# EAGLE design mpp_bldc (EAGLE 9.2.1)
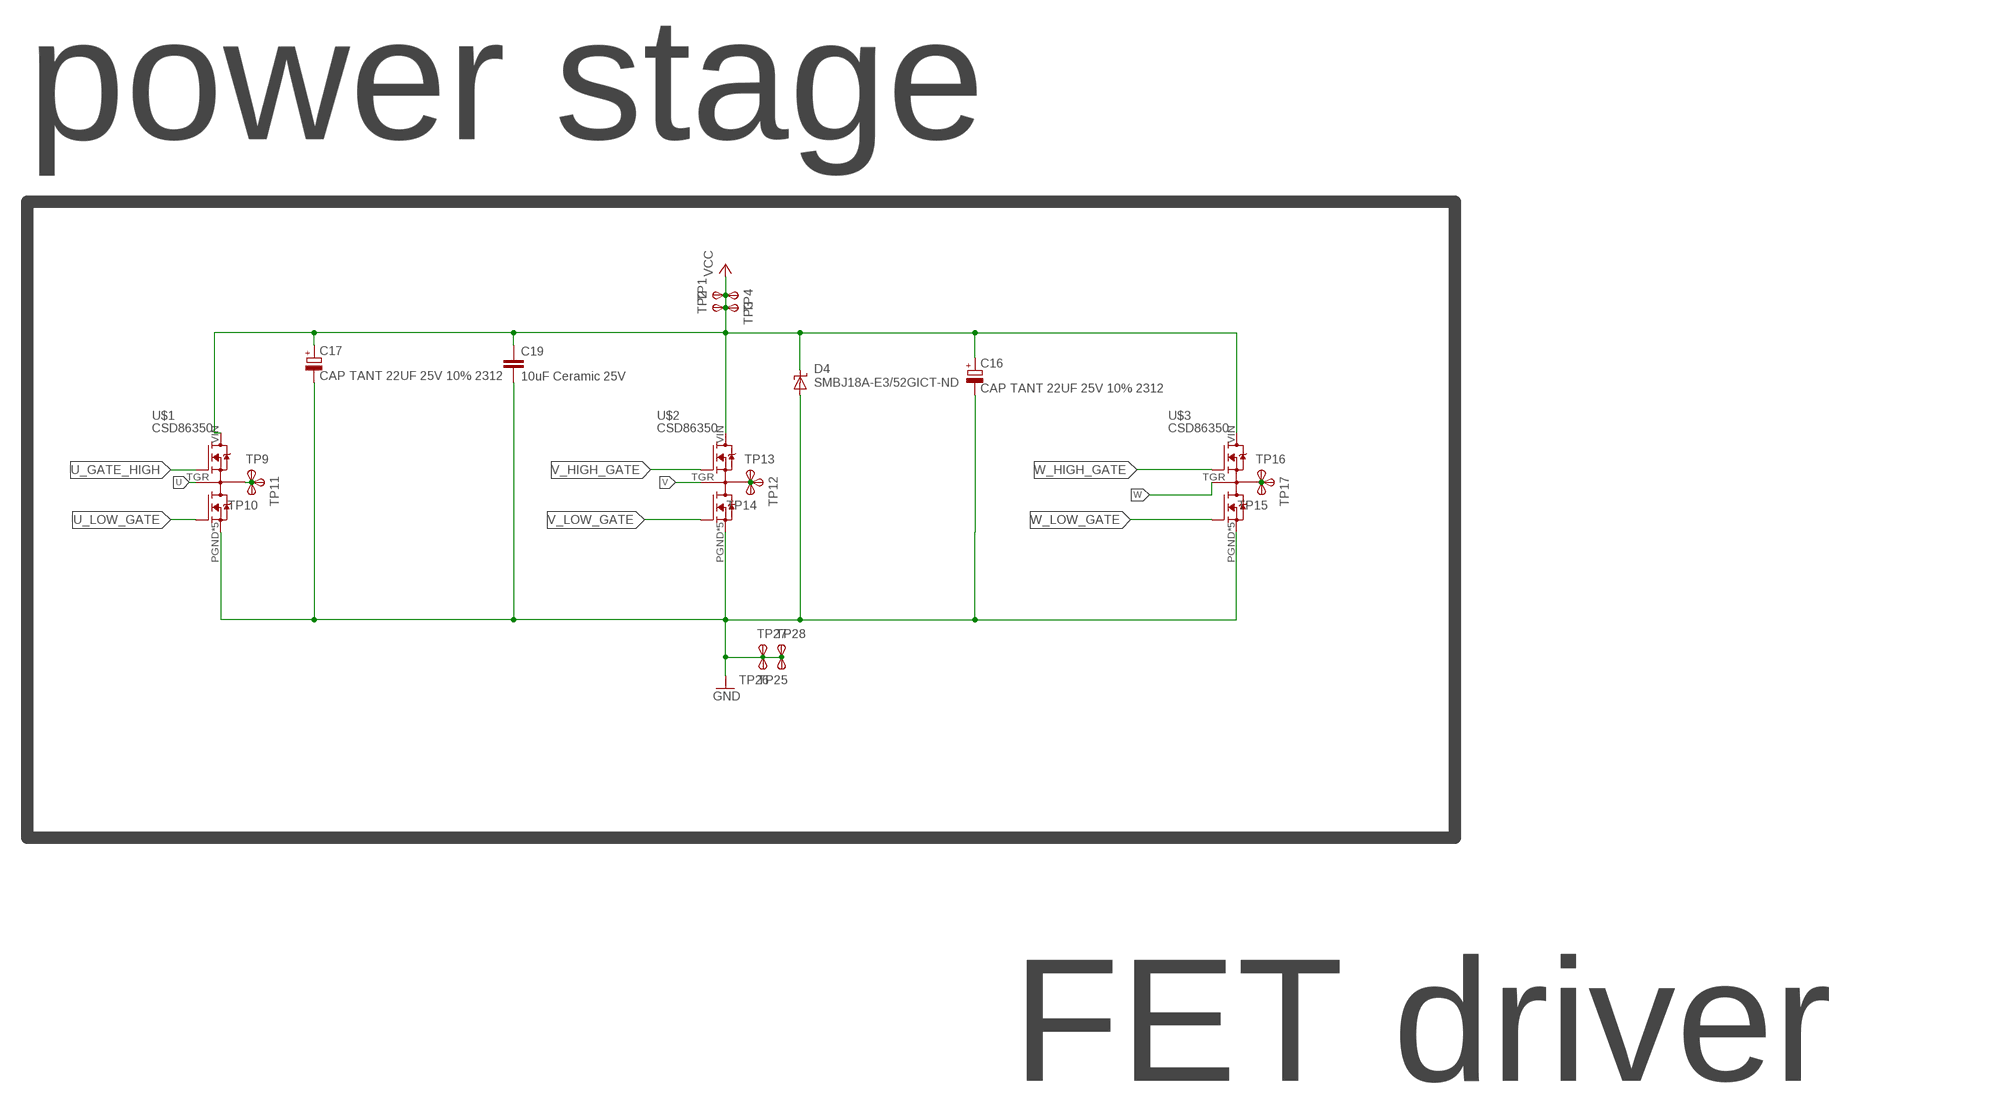
[diagram p0: schematic, sheet 1, part 1 of 2]
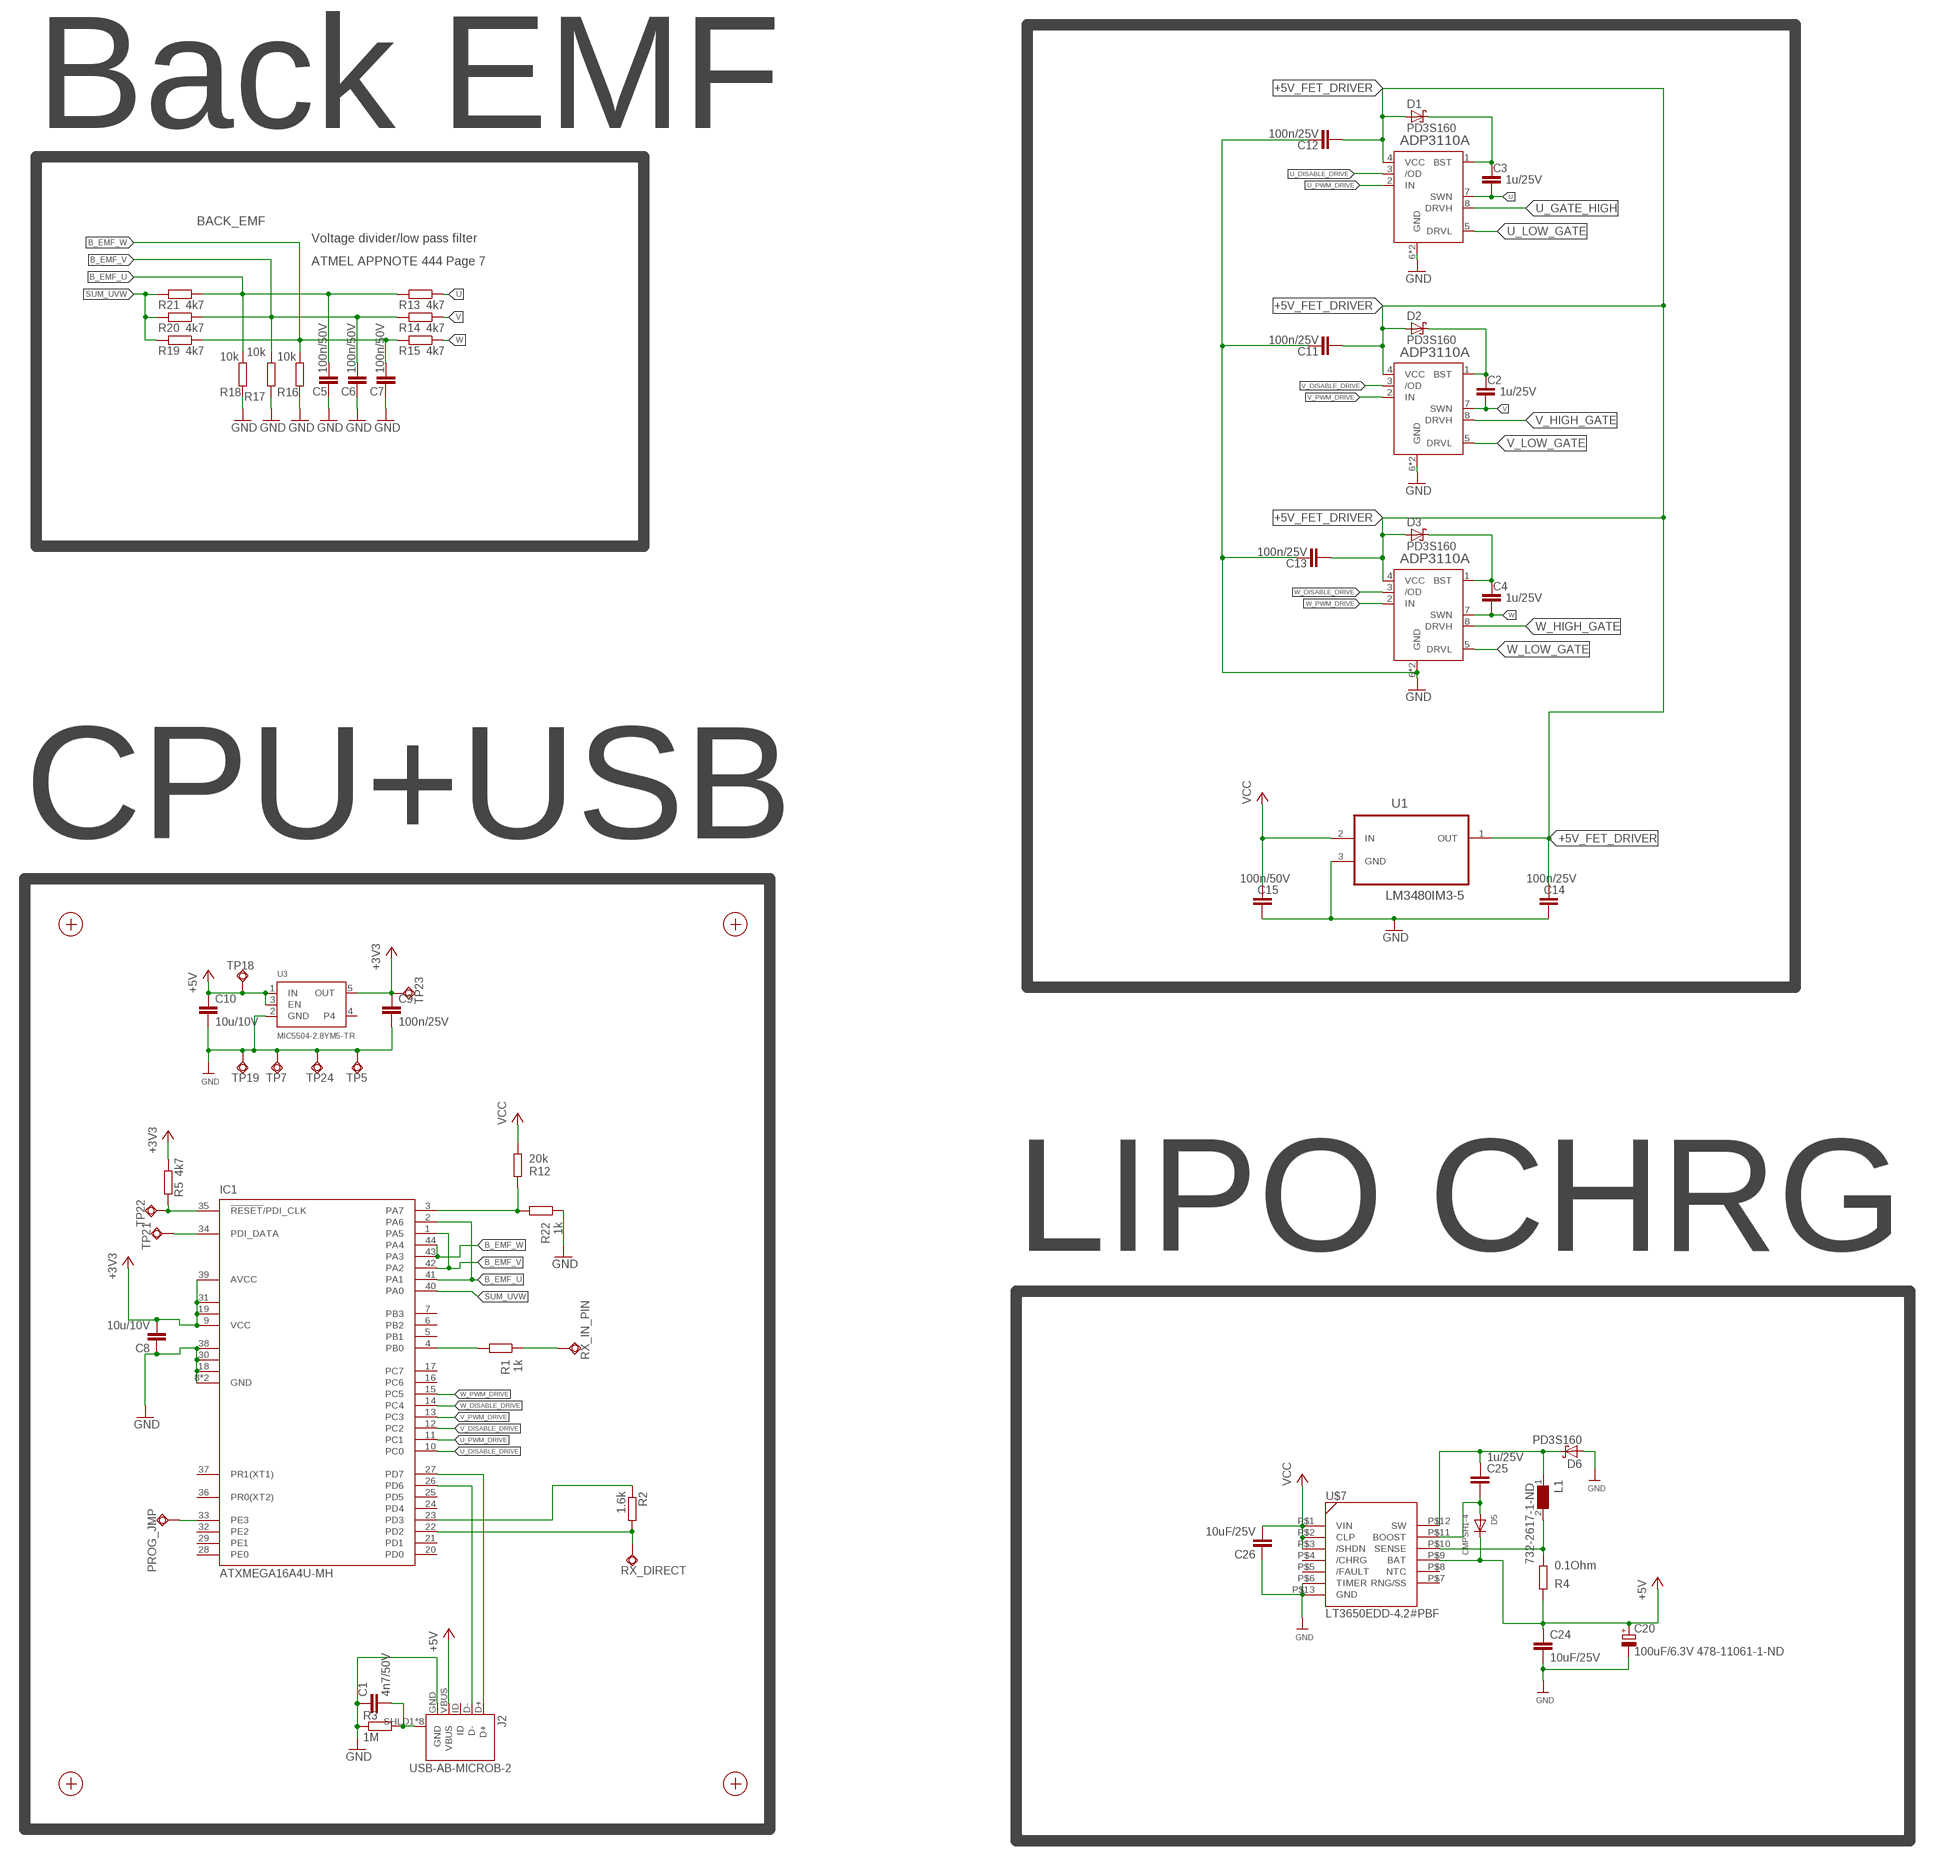
[diagram p1: schematic, sheet 1, part 2 of 2]

## Parts
C1  4n7/50V  C-EUC0603  [C0603]
C2  1u/25V  C-EUC0603  [C0603]
C3  1u/25V  C-EUC0603  [C0603]
C4  1u/25V  C-EUC0603  [C0603]
C5  100n/50V  C-EUC0603  [C0603]
C6  100n/50V  C-EUC0603  [C0603]
C7  100n/50V  C-EUC0603  [C0603]
C8  10u/10V  C-EUC0603K  [C0603K]
C9  100n/25V  C-EUC0603  [C0603]
C10  10u/10V  C-EUC0603K  [C0603K]
C11  100n/25V  C-EUC0603  [C0603]
C12  100n/25V  C-EUC0603  [C0603]
C13  100n/25V  C-EUC0603  [C0603]
C14  100n/25V  C-EUC0603  [C0603]
C15  100n/50V  C-EUC0603  [C0603]
C16  CAP TANT 22UF 25V 10% 2312  CPOL-EUC/6032-28R  [C/6032-28R]
C17  CAP TANT 22UF 25V 10% 2312  CPOL-EUC/6032-28R  [C/6032-28R]
C19  10uF Ceramic 25V  C-EUC1206  [C1206]
C20  100uF/6.3V 478-11061-1-ND  CPOL-EUCT7343  [CT7343]
C24  10uF/25V  C-EUC0805  [C0805]
C25  1u/25V  C-EUC0603  [C0603]
C26  10uF/25V  C-EUC0805  [C0805]
D1  PD3S160  [POWERDI323]
D2  PD3S160  [POWERDI323]
D3  PD3S160  [POWERDI323]
D4  SMBJ18A-E3/52GICT-ND  SUPPRESSOR-SMBJ  [SMBJ]
D5  CMPSH1-4  DIODESOT23_REFLOW  [SOT23-R]
D6  PD3S160  [POWERDI323]
IC1  ATXMEGA16A4U-MH  XMEGA16A4M1  [MLF44-TH]
J2  USB-AB-MICROB-2  [USB-MICROB-10118194]
L1  732-2617-1-ND  WE-TPC-744025001_2828  [WE-TPC_2828]
PROG_JMP  TPSQTP19SQ  [TP19SQ]
R1  1k  R-EU_R0603  [R0603]
R2  1.6k  R-EU_R0603  [R0603]
R3  1M  R-EU_R0603  [R0603]
R4  0.1Ohm  R-EU_R0402  [R0402]
R5  4k7  R-EU_R0603  [R0603]
R12  20k  R-EU_R0603  [R0603]
R13  4k7  R-EU_R0603  [R0603]
R14  4k7  R-EU_R0603  [R0603]
R15  4k7  R-EU_R0603  [R0603]
R16  10k  R-EU_R0603  [R0603]
R17  10k  R-EU_R0603  [R0603]
R18  10k  R-EU_R0603  [R0603]
R19  4k7  R-EU_R0603  [R0603]
R20  4k7  R-EU_R0603  [R0603]
R21  4k7  R-EU_R0603  [R0603]
R22  1k  R-EU_R0603  [R0603]
RX_DIRECT  TPSQTP19SQ  [TP19SQ]
RX_IN_PIN  TPSQTP19SQ  [TP19SQ]
TP1  TPSTP20SQ  [TP20SQ]
TP2  TPSTP20SQ  [TP20SQ]
TP3  TPSTP20SQ  [TP20SQ]
TP4  TPSTP20SQ  [TP20SQ]
TP5  TPSQTP19SQ  [TP19SQ]
TP7  TPSQTP19SQ  [TP19SQ]
TP9  TPSTP20SQ  [TP20SQ]
TP10  TPSTP20SQ  [TP20SQ]
TP11  TPSTP20SQ  [TP20SQ]
TP12  TPSTP20SQ  [TP20SQ]
TP13  TPSTP20SQ  [TP20SQ]
TP14  TPSTP20SQ  [TP20SQ]
TP15  TPSTP20SQ  [TP20SQ]
TP16  TPSTP20SQ  [TP20SQ]
TP17  TPSTP20SQ  [TP20SQ]
TP18  TPSQTP19SQ  [TP19SQ]
TP19  TPSQTP19SQ  [TP19SQ]
TP21  TPSQTP15R  [TP15R]
TP22  TPSQTP14SQ  [TP14SQ]
TP23  TPSQTP14SQ  [TP14SQ]
TP24  TPSQTP14SQ  [TP14SQ]
TP25  TPSTP20SQ  [TP20SQ]
TP26  TPSTP20SQ  [TP20SQ]
TP27  TPSTP20SQ  [TP20SQ]
TP28  TPSTP20SQ  [TP20SQ]
U1  LM3480IM3-5  LM3480IM3-12  [SOT95P251X112-3N]
U3  MIC5504-2.8YM5-TR  VREG_SOT23-5  [SOT23-5]
U$1  CSD86350  [Q5D]
U$2  CSD86350  [Q5D]
U$3  CSD86350  [Q5D]
U$4  ADP3110A  [DFN-8]
U$5  ADP3110A  [DFN-8]
U$6  ADP3110A  [DFN-8]
U$7  LT3650EDD-4.2#PBF  LT3650-4.2  [12-WFDFN]
X1  PASSER-07  [PASSER_07MM]
X2  PASSER-07  [PASSER_07MM]
X3  PASSER-07  [PASSER_07MM]
X4  PASSER-07  [PASSER_07MM]

## Nets
+3V3: C8.2 C9.1 IC1.9(VCC) IC1.19(VCC1) IC1.31(VCC2) IC1.39(AVCC) R5.1 TP23.TP U3.5(OUT)
+5V: C10.1 C20.+ C24.1 D5.3(C) J2.VBUS R4.2 TP18.TP U3.1(IN) U3.3(EN) U$7.P$9(BAT)
+5V_FET_DRIVER: C11.2 C12.2 C13.2 C14.2 D1.A D2.A D3.A U1.1(OUT) U$4.4(VCC) U$5.4(VCC) U$6.4(VCC)
B_EMF_U: C5.1 IC1.2(PA6) IC1.41(PA1) R13.2 R18.1 R21.1
B_EMF_V: C6.1 IC1.1(PA5) IC1.42(PA2) R14.2 R17.1 R20.1
B_EMF_W: C7.1 IC1.43(PA3) IC1.44(PA4) R15.2 R16.1 R19.1
GND: C1.1 C5.2 C6.2 C7.2 C8.1 C9.2 C10.2 C11.1 C12.1 C13.1 C14.1 C15.1 C16.- C17.- C19.2 C20.- C24.2 C26.1 D4.A D6.A IC1.8(GND) IC1.18(GND1) IC1.30(GND2) IC1.38(GND3) IC1.TH(GND) J2.GND R3.1 R16.2 R17.2 R18.2 R22.1 TP5.TP TP7.TP TP19.TP TP24.TP TP25.TP(PP) TP26.TP(PP) TP27.TP(PP) TP28.TP(PP) U1.3(GND) U3.2(GND) U$1.PGND U$1.PGND0(PGND) U$1.PGND1(PGND) U$1.PGND2(PGND) U$1.PGND3(PGND) U$2.PGND U$2.PGND0(PGND) U$2.PGND1(PGND) U$2.PGND2(PGND) U$2.PGND3(PGND) U$3.PGND U$3.PGND0(PGND) U$3.PGND1(PGND) U$3.PGND2(PGND) U$3.PGND3(PGND) U$4.6(GND) U$4.PAD(GND) U$5.6(GND) U$5.PAD(GND) U$6.6(GND) U$6.PAD(GND) U$7.P$6(TIMER) U$7.P$13(GND)
N$1: IC1.33(PE3) PROG_JMP.TP
N$2: IC1.3(PA7) R12.2 R22.2
N$3: C3.2 D1.C U$4.1(BST)
N$4: IC1.27(PD7) J2.D+
N$5: IC1.26(PD6) J2.D-
N$6: C2.2 D2.C U$5.1(BST)
N$7: C4.2 D3.C U$6.1(BST)
N$12: C25.1 D6.C L1.1 U$7.P$12(SW)
N$14: L1.2 R4.1 U$7.P$10(SENSE)
N$15: C1.2 J2.SHLD1(SHIELD) J2.SHLD2(SHIELD) J2.SHLD3(SHIELD) J2.SHLD4(SHIELD) J2.SHLD5(SHIELD) J2.SHLD6(SHIELD) J2.SHLD7(SHIELD) J2.SHLD8(SHIELD) R3.2
N$16: C25.2 D5.1(A) U$7.P$11(BOOST)
PDI_DATA: IC1.34(PDI_DATA) TP21.TP
RC_SIG_IC: IC1.4(PB0) R1.2
RC_SIG_RCV: R1.1 RX_IN_PIN.TP
RST_PDICLK: IC1.35(!RESET!/PDI_CLK) R5.2 TP22.TP
RX_DIRECT_PD2: IC1.22(PD2) R2.2 RX_DIRECT.TP
SUM_UVW: IC1.40(PA0) R19.2 R20.2 R21.2
TX_DIRECT_PD3: IC1.23(PD3) R2.1
U: C3.1 R13.1 U$1.TGR U$4.7(SWN)
U_DISABLE_DRIVE: IC1.10(PC0) U$4.3(/OD)
U_GATE_HIGH: U$1.TG U$4.8(DRVH)
U_LOW_GATE: U$1.BG U$4.5(DRVL)
U_PWM_DRIVE: IC1.11(PC1) U$4.2(IN)
UMOT: TP9.TP(PP) TP10.TP(PP) TP11.TP(PP) U$1.VSW0(VSW) U$1.VSW1(VSW) U$1.VSW2(VSW)
V: C2.1 R14.1 U$2.TGR U$5.7(SWN)
V_DISABLE_DRIVE: IC1.12(PC2) U$5.3(/OD)
V_HIGH_GATE: U$2.TG U$5.8(DRVH)
V_LOW_GATE: U$2.BG U$5.5(DRVL)
V_PWM_DRIVE: IC1.13(PC3) U$5.2(IN)
VCC: C15.2 C16.+ C17.+ C19.1 C26.2 D4.C R12.1 TP1.TP(PP) TP2.TP(PP) TP3.TP(PP) TP4.TP(PP) U1.2(IN) U$1.VIN U$2.VIN U$3.VIN U$7.P$1(VIN) U$7.P$2(CLP) U$7.P$3(/SHDN)
VMOT: TP12.TP(PP) TP13.TP(PP) TP14.TP(PP) U$2.VSW0(VSW) U$2.VSW1(VSW) U$2.VSW2(VSW)
W: C4.1 R15.1 U$3.TGR U$6.7(SWN)
W_DISABLE_DRIVE: IC1.14(PC4) U$6.3(/OD)
W_HIGH_GATE: U$3.TG U$6.8(DRVH)
W_LOW_GATE: U$3.BG U$6.5(DRVL)
W_PWM_DRIVE: IC1.15(PC5) U$6.2(IN)
WMOT: TP15.TP(PP) TP16.TP(PP) TP17.TP(PP) U$3.VSW0(VSW) U$3.VSW1(VSW) U$3.VSW2(VSW)
Unconnected: IC1.5(PB1) IC1.6(PB2) IC1.7(PB3) IC1.16(PC6) IC1.17(PC7) IC1.20(PD0) IC1.21(PD1) IC1.24(PD4) IC1.25(PD5) IC1.28(PE0) IC1.29(PE1) IC1.32(PE2) IC1.36(PR0(XT2)) IC1.37(PR1(XT1)) J2.ID U3.4 U$7.P$4(/CHRG) U$7.P$5(/FAULT) U$7.P$7(RNG/SS) U$7.P$8(NTC)

## Notes on the sheet
- power stage
- FET driver
- Back EMF
- BACK_EMF
- Voltage divider/low pass filter
- ATMEL APPNOTE 444 Page 7
- CPU+USB
- LIPO CHRG

## Library data of the parts
C1-C15 C24-C26 = rcl:C-EU: CAPACITOR, European symbol
C16 C17 = rcl:CPOL-EU: POLARIZED CAPACITOR, European symbol; SPICEPREFIX: C
C19 = rcl:C-EU: CAPACITOR, European symbol; SPICEPREFIX: C
C20 = rcl:CPOL-EU: POLARIZED CAPACITOR, European symbol
D1-D3 = mpp_bldc_ng_2:PD3S160: 1.0A SURFACE MOUNT SCHOTTKY BARRIER RECTIFIER POWERDI ® 323 Source: http://www.diodes.com/datasheets/ds30899.pdf
D4 = diode:SUPPRESSOR-: Suppressor diode
D5 = adafruit:DIODE: Diode SMADIODE - SMA Surface Mount Package 20V 1A Schottky Diode Digikey: 641-1014-6-ND DO-1N4148 - Through Hole Small Current Diode SOD-123 20V 1 A (.5mV Vf) Schottky Diode - Digikey: MBRX120TPMSCT-ND SOD-323 10V 570mA (.38mV Vf, 3ns) Schottky Diode - Digikey: ZLLS410CT-ND SOD-523 30V 30mA Schottky Diode (RB751S-40TE61) - Digikey: RB751S-40TE61CT-ND SOT23-R/W - SOT23 Package (R = Solder Paste/Reflow Ovens, W = Hand-Soldering) BAT54Film 40V 300mA - Digikey: 497-7162-1-ND
D6 = diode:PD3S160: 1.0A SURFACE MOUNT SCHOTTKY BARRIER RECTIFIER POWERDI ® 323 Source: http://www.diodes.com/datasheets/ds30899.pdf
IC1 = atmel:XMEGA16A4: MICROCONTROLLER Features High-performance, Low-power 8/16-bit AVR XMEGA Microcontroller Non-Volatile Program and Data Memories - 16 KB - 128 KB of In-System Self-Programmable Flash - 4 KB - 8 KB Boot Code Section with Independent Lock Bits - 1 KB - 2 KB EEPROM - 2 KB - 8 KB Internal SRAM Peripheral Features - Four-channel DMA Controller with support for external requests - Eight-channel Event System - Five 16-bit Timer/Counters Three Timer/Counters with 4 Output Compare or Input Capture channels Two Timer/Counters with 2 Output Compare or Input Capture channels High-Resolution Extensions on all Timer/Counters Advanced Waveform Extension on one Timer/Counter - Five USARTs IrDA Extension on one USART - Two Two-Wire Interfaces with dual address match (I2C and SMBus compatible) - Two SPIs (Serial Peripheral Interfaces) peripherals - AES and DES Crypto Engine - 16-bit Real Time Counter with Separate Oscillator - One Twelve-channel, 12-bit, 2 Msps Analog to Digital Converter - One Two-channel, 12-bit, 1 Msps Digital to Analog Converter - Two Analog Comparators with Window compare function - External Interrupts on all General Purpose I/O pins - Programmable Watchdog Timer with Separate On-chip Ultra Low Power Oscillator Special Microcontroller Features - Power-on Reset and Programmable Brown-out Detection - Internal and External Clock Options with PLL - Programmable Multi-level Interrupt Controller - Sleep Modes: Idle, Power-down, Standby, Power-save, Extended Standby - Advanced Programming, Test and Debugging Interfaces PDI (Program and Debug Interface) for programming, test and debugging I/O and Packages - 34 Programmable I/O Lines - 44 - lead TQFP - 44 - pad VQFN/QFN - 49 - ball VFBGA Operating Voltage - 1.6 - 3.6V Speed performance - 0 - 12 MHz @ 1.6 - 3.6V - 0 - 32 MHz @ 2.7 - 3.6V Drawn by Dipl.-Ing. (FH) Robert Siegler Created: 27.05.09; OC_FARNELL: unknown; OC_NEWARK: unknown
J2 = mpp_bldc_ng_2:USB-AB: USB Connectors with ID-Pin (5 Pins); DIGIKEY: 609-4618-6-ND
L1 = WE-TPC:WE-TPC: Shielded Tiny Power Inductor WE-TPC - Extremely flat power inductor - High current capability - High reliability and perfect soldering characteristics because of integrated soldering pad - magnetically shielded -- Portable power like PDA, digital camera, PCMICA-cards and displays -- DC/DC-converter -- Recommended for switching regulator IC's from Linear Technology, National Semiconductor, Texas Instruments and Fairchild Semiconductor; MPN: 744025001; OC_FARNELL: 1869740; OC_NEWARK: 32T8552; PACKAGE: 2828; SUPPLIER: WURTH ELEKTRONIK
PROG_JMP RX_DIRECT RX_IN_PIN TP5 TP7 TP18 TP19 TP21-TP24 = testpad:TPSQ: Test pad
R1 R4 R5 R12-R22 = rcl:R-EU_: RESISTOR, European symbol
R2 R3 = resistor:R-EU_: RESISTOR, European symbol
TP1-TP4 TP9-TP17 TP25-TP28 = testpad:TPS: TEST PIN
U1 = linear:LM3480IM3-12: Low-Dropout Linear Voltage; MPN: LM3480IM3-12; OC_FARNELL: 1469099; OC_NEWARK: -; PACKAGE: SOT-3; SUPPLIER: National Semiconductor
U3 = microbuilder:VREG_SOT23-5: SOT23-5 Fixed Voltage Regulators To better organise some of the SOT23-5 fixed voltage regulators in this library, this new part was created. Part Current Out V Out V In V Dropout Digikey Part No. ADP121 150mA 3.3V 3.4-5.5V 0.09V @ 150mA ADP121-AUJZ33R7CT-ND ADP121 150mA 3.0V 3.1-5.5V 0.09V @ 150mA ADP121-AUJZ30R7CT-ND ADP122 300mA 3.3V 3.4-5.5V 0.085V @ 300mA ADP122AUJZ-3.3-R7CT-ND ADP1712 300mA 3.3V 3.5-5.5V 0.17V @ 300mA ADP1712AUJZ-3.3-R7TR-ND AP7311 (Low Cost) 150mA 3.3V 3.5-6V 0.15V @ 150mA AP7311-33WG-7DICT-ND LD39015M18R 150mA 1.8V 1.9V-5.5V 0.08V @ 100mA 497-6977-1-ND MCP1824T-3302E/OT 300mA 3.3V 3.5V-6V 0.2V @ 300mA MCP1824T-3302E/OTCT-ND MIC5205-2.5YM5 TR 150mA 2.5V 2.7-16V 0.165V @ 150mA 576-1257-2-ND MIC5205-3.0YM5 TR 150mA 3.0V 3.2V-16V 0.165V @ 150mA 576-1258-2-ND MIC5205-3.3YM5 TR 150mA 3.3V 3.5V-16V 0.165V @ 150mA 576-1259-2-ND TPS780330220 150mA 3.3V+2.2V 3.6-5.5V 250mV Max 296-23332-1-ND TDA3663/N1,135 100mA 3.3V 3.5-45V 0.18V @ 50mA 568-5343-1-ND
U$1-U$3 = mpp_bldc_ng_2:CSD86350
U$4-U$6 = mpp_bldc_ng_2:ADP3110A: High and Low Fet Driver
U$7 = mpp_bldc_ng_2:LT3650-4.2
X1-X4 = we-symbol:PASSER: Fiducial Marker

## Board
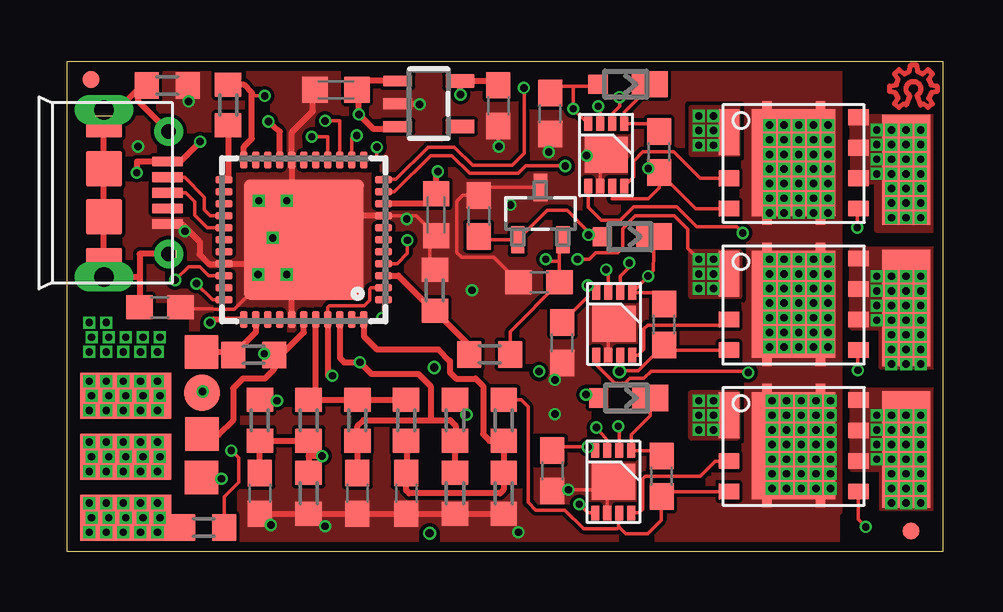
[diagram p2: board, top side]
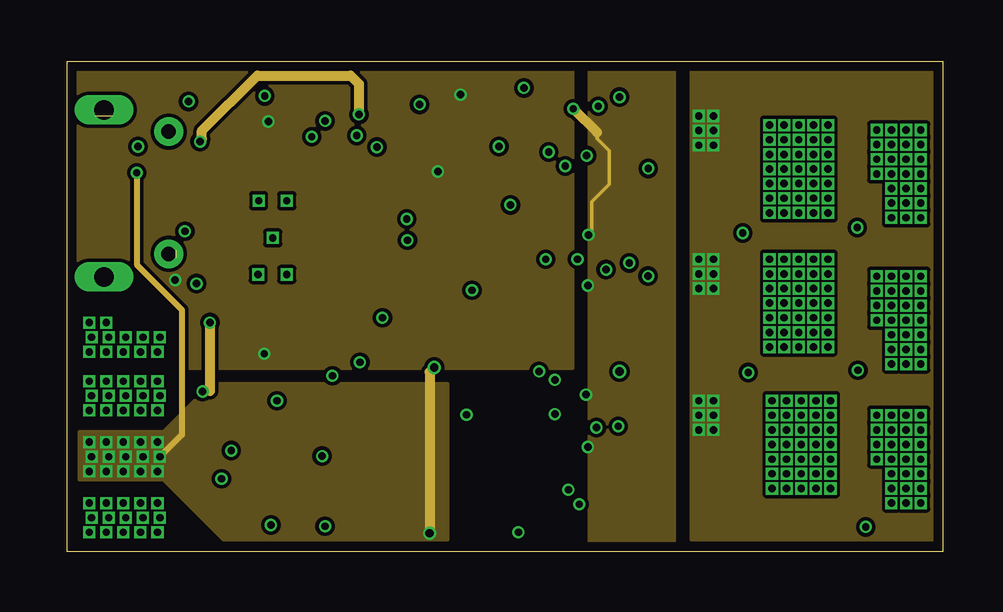
[diagram p3: board, inner layer Route3]
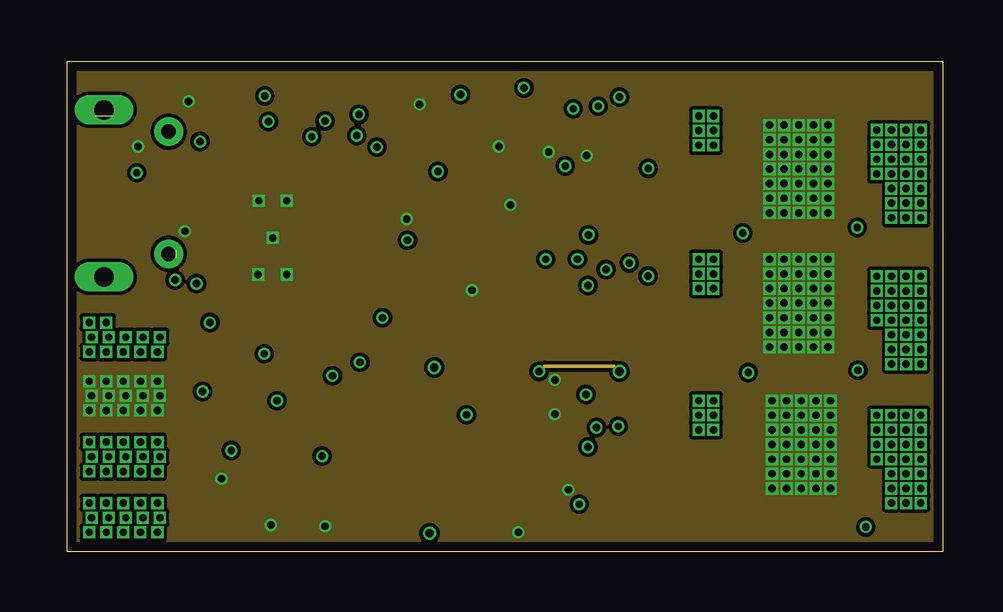
[diagram p4: board, inner layer Route14]
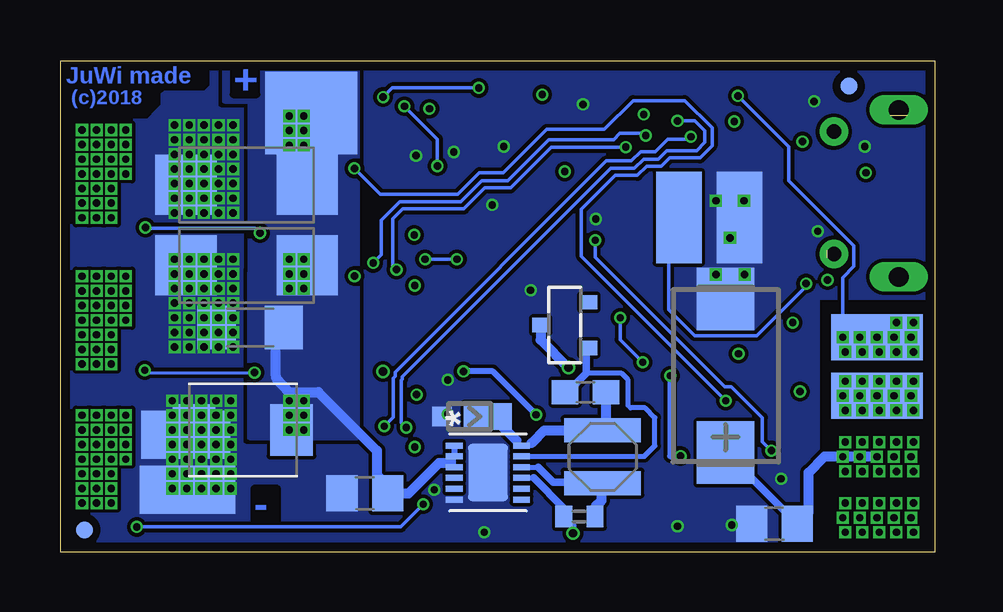
[diagram p5: board, bottom side, seen from below]

Size 36.47 x 20.45 mm. Coordinates in mm from the lower left corner, seen from the top.
Outline: 0,0 0,20.45 36.47,20.45 36.47,0 0,0
Copper layers (1+2*15+16): Top 0.035mm / dielectric 0.35mm / Route3 0.035mm / dielectric 0.76mm / Route14 0.035mm / dielectric 0.35mm / Bottom 0.035mm
Design rules "we-dru-4-layer *": minimum track width 0.15mm, minimum drill 0.3mm, track to track 0.15mm, track to pad 0.15mm, pad to pad 0.15mm, via to via 0.15mm, smd to smd 0mil, copper to edge 0.4mm, drill to drill 0.2mm, minimum pad ring 0.18mm, minimum via ring 0.1mm, stop-mask expansion 0.1mm, vias tented up to drill 0.5mm, thermal gap 0.25mm

### Footprints (pad centres in the part's own frame; a part is rotated, then mirrored left to right if it is on the bottom)
C0603 = smd 1.1 x 1: 1 -0.85,0; 2 0.85,0
C0603K = smd 1.05 x 1.08: 1 -0.875,0; 2 0.875,0
C/6032-28R = smd 2.55 x 2.5: + 2.525,0; - -2.525,0
C1206 = smd 1.6 x 1.8: 1 -1.4,0; 2 1.4,0
CT7343 = smd 2.6 x 2.4: + -3.2,0; - 3.2,0
C0805 = smd 1.3 x 1.5: 1 -0.95,0; 2 0.95,0
POWERDI323 = smd 0.8 x 0.8: A 1.15,0 | smd 1.492 x 1.1: C -1.004,0
SMBJ = smd 1.78 x 2.16: A 2.04,0; C -2.03,0
SOT23-R = smd 0.6 x 0.7: 1 -0.95,-1; 2 0.95,-1; 3 0,1
POWERDI323' = smd 0.8 x 0.8: A 1.15,0 | smd 2 x 1.1: C -0.75,0
MLF44-TH = smd 0.7 x 0.3: 1 -3.325,2.5; 2 -3.325,2; 3 -3.325,1.5; 4 -3.325,1; 5 -3.325,0.5; 6 -3.325,0; 7 -3.325,-0.5; 8 -3.325,-1; 9 -3.325,-1.5; 10 -3.325,-2; 11 -3.325,-2.5; 23 3.325,-2.5; 24 3.325,-2; 25 3.325,-1.5; 26 3.325,-1; 27 3.325,-0.5; 28 3.325,0; 29 3.325,0.5; 30 3.325,1; 31 3.325,1.5; 32 3.325,2; 33 3.325,2.5 | smd 0.3 x 0.7: 12 -2.5,-3.325; 13 -2,-3.325; 14 -1.5,-3.325; 15 -1,-3.325; 16 -0.5,-3.325; 17 0,-3.325; 18 0.5,-3.325; 19 1,-3.325; 20 1.5,-3.325; 21 2,-3.325; 22 2.5,-3.325; 34 2.5,3.325; 35 2,3.325; 36 1.5,3.325; 37 1,3.325; 38 0.5,3.325; 39 0,3.325; 40 -0.5,3.325; 41 -1,3.325; 42 -1.5,3.325; 43 -2,3.325; 44 -2.5,3.325 | smd 5 x 5: TH 0,0
USB-MICROB-10118194 = smd 1.3 x 0.4: D+ -2.5,0; D- -2.5,-0.65; GND -2.5,1.3; ID -2.5,0.65; VBUS -2.5,-1.3 | drill 0.6 pad 1.2: SHLD1 -2.55,2.55; SHLD2 -2.55,-2.55 | drill 0.813 pad 1.219 long: SHLD3 0.15,3.5; SHLD4 0.15,-3.45 | smd 1.5 x 1.1: SHLD5 0.15,2.85; SHLD6 0.15,-2.85 | smd 1.5 x 1.5: SHLD7 0.15,1; SHLD8 0.15,-1
WE-TPC_2828 = smd 3.2 x 1: 1 0,1.1; 2 0,-1.1
TP19SQ = smd 3.81 x 1.9: TP 0,0
R0603 = smd 1 x 1.1: 1 -0.85,0; 2 0.85,0
R0402 = smd 0.7 x 0.9: 1 -0.65,0; 2 0.65,0
TP20SQ = smd 2 x 2: TP 0,0
TP15R = smd 1.5 x 1.5: TP 0,0
TP14SQ = smd 1.4 x 1.4: TP 0,0
SOT95P251X112-3N = smd 0.559 x 1.143: 1 -0.94,-1.092; 2 0.94,-1.092; 3 0,1.092
SOT23-5 = smd 0.457 x 1.2: 1 -0.95,-1.3; 2 0,-1.3; 3 0.95,-1.3 | smd 0.55 x 1.2: 4 0.95,1.3; 5 -0.95,1.3
Q5D = smd 0.85 x 0.65: BG 2.686,-1.958; TG -2.704,-0.688; TGR -2.704,-1.958; VSW0 2.686,1.852; VSW1 2.686,0.582; VSW2 2.686,-0.688 | smd 3.48 x 4.46: PGND -0.024,-0.048 | smd 0.4 x 0.345: PGND0 -1.124,2.352; PGND1 1.116,2.352; PGND2 -1.124,-2.448; PGND3 1.116,-2.448 | smd 0.85 x 1.92: VIN -2.704,1.222
DFN-8 = smd 0.6 x 0.33: 1 -1.3,0.725; 2 -1.3,0.225; 3 -1.3,-0.275; 4 -1.3,-0.775; 5 1.3,-0.775; 6 1.3,-0.275; 7 1.3,0.225; 8 1.3,0.725 | smd 1.5 x 1.8: PAD 0,-0.025
12-WFDFN = smd 0.25 x 0.7: P$1 -1.125,-1.4; P$2 -0.675,-1.4; P$3 -0.225,-1.4; P$4 0.225,-1.4; P$5 0.675,-1.4; P$6 1.125,-1.4; P$7 1.125,1.4; P$8 0.675,1.4; P$9 0.225,1.4; P$10 -0.225,1.4; P$11 -0.675,1.4; P$12 -1.125,1.4 | smd 2.38 x 1.65: P$13 0,0
PASSER_07MM = smd 0.7 x 0.7: X 0,0

### Placement (x,y rotation side)
C1  3.86,10.19 180 top
C2  24.87,9.47 90 top
C3  24.66,16.66 90 top
C4  24.77,3.15 90 top
C5  8.03,2.44 270 top
C6  12.09,2.44 270 top
C7  14.12,2.44 270 top
C8  15.37,14.05 90 top
C9  17.96,18.59 270 top
C10  11.2,19.25 180 top
C11  20.12,18.26 90 top
C12  20.62,8.71 90 top
C13  20.22,3.38 90 top
C14  17.14,14 270 top
C15  19.66,11.23 0 top
C16  28.7,15.29 0 bottom
C17  28.7,11.94 0 bottom
C19  28.55,9.35 180 bottom
C20  8.74,7.34 90 bottom
C24  6.71,1.17 180 bottom
C25  14.58,6.65 180 bottom
C26  23.77,2.44 0 bottom
D1  23.27,19.48 180 top
D2  23.44,13.13 180 top
D3  23.29,6.41 180 top
D4  28.85,5.08 180 bottom
D5  15.44,9.45 90 bottom
D6  PD3S160  [POWERDI323']  19.41,5.64 180 bottom
IC1  9.86,13 180 top
J2  1.68,14.96 180 top
L1  13.87,3.96 0 bottom
PROG_JMP  10.69,13.94 270 bottom
R1  5.69,1.02 0 top
R2  6.71,18.62 90 top
R3  4.17,19.43 180 top
R4  14.83,1.47 180 bottom
R5  7.77,8.2 180 top
R12  17.6,8.23 180 top
R13  8.03,5.49 270 top
R14  16.15,5.49 270 top
R15  18.19,5.49 270 top
R16  18.19,2.44 270 top
R17  16.15,2.44 270 top
R18  10.06,2.44 270 top
R19  14.12,5.49 90 top
R20  12.09,5.49 90 top
R21  10.06,5.49 90 top
R22  15.32,10.9 270 top
RX_DIRECT  2.44,8.94 0 bottom
RX_IN_PIN  2.44,1.42 0 top
TP1  25.1,17.58 0 bottom
TP2  26.92,19 0 bottom
TP3  26.92,17.58 0 bottom
TP4  25.1,19 0 bottom
TP5  8.16,13.94 90 bottom
TP7  2.44,6.5 0 bottom
TP9  34.95,17.22 0 top
TP10  34.95,16.26 0 top
TP11  34.95,14.63 0 top
TP12  34.95,11.58 0 top
TP13  34.95,10.16 0 top
TP14  34.95,8.74 0 top
TP15  34.95,2.84 0 top
TP16  34.95,4.27 0 top
TP17  34.95,5.69 0 top
TP18  2.44,3.96 180 top
TP19  2.44,6.5 180 top
TP21  5.61,6.63 90 top
TP22  5.59,8.33 90 top
TP23  5.61,4.9 90 top
TP24  5.59,3.1 90 top
TP25  30.38,4.88 0 bottom
TP26  32.08,4.88 0 bottom
TP27  32.16,2.59 0 bottom
TP28  30.18,2.59 0 bottom
U1  19.71,14.1 0 top
U3  15.06,18.67 270 top
U$1  30.28,16.26 0 top
U$2  30.28,10.36 0 top
U$3  30.28,4.47 0 top
U$4  22.48,16.54 270 top
U$5  22.81,9.5 270 top
U$6  22.78,2.92 270 top
U$7  18.64,3.3 270 bottom
U$11  [OSHW_2MM]  35.26,19.41 0 top
X1  35.15,0.86 0 top
X2  0.99,19.68 0 top
X3  35.46,0.91 0 bottom
X4  3.61,19.41 0 bottom

### Tracks (layer width: path | path; a pad name or v marks a point on that pad's centre or on a via)
+3V3  (via drill 0.3)
  Top 0.152: IC1.31 5.89,11.51 5.51,11.89 5.05,11.89 v4.5,11.33 | R5.1 8.57,8.26 v8.2,8.26
  Top 0.254: C9.1 17.88,19.62 U3.5 16.36,19.07 v16.38,19.05 | v15.44,15.85 15.37,15.77 C8.2 14.95,14.51 IC1.9 | IC1.19 8.86,17.51 v8.38,17.93 | IC1.39 9.86,9.14 8.91,8.2 R5.1 8.62,7.61 8.23,7.21 7.32,7.21 6.91,6.81 6.91,5.49 6.3,4.88 5.64,4.88 TP23.TP
  pour Route3 (no thermals): -0.15,20.55 21.06,20.55 21.06,7.65 -0.15,7.65
+5V  (via drill 0.3, 0.35)
  Top 0.254: v0.91,3.35 v1.02,3.96 v0.91,4.57 v1.63,4.57 v1.73,3.96 v1.63,3.35 v2.34,3.35 TP18.TP | TP18.TP v2.34,4.57 | TP18.TP v3.15,3.96 | v3.15,3.96 v3.05,4.57 | v3.15,3.96 3.05,3.86 | 3.05,3.86 2.44,3.86 TP18.TP | 3.05,3.86 v3.05,3.35 v3.76,3.35 v3.86,3.96 v3.76,4.57 | v2.9,15.8 2.9,16.26 J2.VBUS 4.7,16.26 v5.54,17.09 | U3.3 13.67,17.63 12.75,17.63 v12.15,18.23 C10.1 12.52,19.62 U3.1
  Route3 0.254: v2.9,15.8 2.9,11.96 4.78,10.08 4.78,4.88 v3.86,3.96
  Route3 0.305: v15.1,0.78
  Route3 0.406: v5.54,17.09 5.54,17.12 5.61,17.2 5.61,17.55 7.92,19.84 11.81,19.84 12.15,19.5 v12.15,18.23 | v15.29,7.68 15.1,7.49 v15.1,0.78
  Bottom 0.152: 2.34,3.96 TP18.TP | TP18.TP 2.59,3.96 | 2.59,3.96 2.69,3.86 2.59,3.96 | 2.59,3.96 TP18.TP | 2.34,3.96 TP18.TP | TP18.TP 2.69,3.96 | 2.34,3.96 TP18.TP
  Bottom 0.203: U$7.P$9 16.74,3.08
  Bottom 0.305: 16.74,3.08 15.48,1.82 R4.2 15.1,1.09 v15.1,0.78 | C20.+ 6.89,2.29 6.87,2.29 C24.1
  Bottom 0.406: C24.1 5.28,1.64 5.28,3.3 4.62,3.96 2.69,3.96 | D5.3 16.44,8.83 v15.29,7.68
  other vias: 2.44,3.96
  pour Route3: 15.84,0.5 15.84,7 6,7 4,5 0.5,5 0.5,3 4,3 6.5,0.5
+5V_FET_DRIVER  (via drill 0.3)
  Top 0.152: D2.A 22.27,13.12 v21.72,13.21 21.72,13.34 20.83,14.22 19.99,14.22 U1.1 17.29,13.01 C14.2 | U$6.4 21.84,4.22 v21.69,4.37 20.36,4.37 C13.2 | v21.61,6.55 22,6.55 D3.A | U$5.4 21.87,10.96 v21.69,11.1 21.69,10.63 C12.2 | D1.A 22.05,19.41 21.08,19.41 | 21.08,19.41 20.41,19.41 C11.2 | 21.08,19.41 v21.08,18.47 21.13,18.41 U$4.4
  Route3 0.152: 22.07,17.48 22.07,17.22 22.58,16.71 22.58,15.32 21.84,14.58 21.84,13.34 21.74,13.23 v21.72,13.21
  Route3 0.406: v21.08,18.47 22.07,17.48
  pour Route3 (rank 6, no thermals): 21.74,20.65 25.3,20.65 25.3,-0.1 21.74,-0.1
B_EMF_U  (via drill 0.3)
  Top 0.152: IC1.2 12.66,11.01 12.6,10.95 12.6,10.49 12.37,10.26 10.92,10.26 10.85,10.19 10.85,9.69 IC1.41
  Top 0.254: 10.06,3.99 R21.1 R13.2 C5.1 | 10.06,3.99 R18.1 | IC1.41 10.86,7.34 v11.05,7.34 | v10.62,3.99 10.06,3.99
  Bottom 0.254: v11.05,7.34 11.05,3.99 v10.62,3.99
B_EMF_V  (via drill 0.3)
  Top 0.152: IC1.1 13.18,9.8 v13.13,9.75
  Top 0.254: C6.1 R20.1 12.09,5.23 12.34,5.49 15.14,5.49 | 15.14,5.49 15.95,5.49 16.18,5.26 16.18,4.66 R14.2 R17.1 | IC1.42 11.36,8.08 11.53,7.9 v12.19,7.9 12.68,7.41 14.64,7.41 15.14,6.91 15.14,5.49
  Bottom 0.152: v13.13,9.75 13.13,8.84 v12.19,7.9
B_EMF_W
  Top 0.254: IC1.43 IC1.44 12.36,8.98 12.9,8.43 15.46,8.43 15.94,7.95 15.94,7.48 16.2,7.21 17.02,7.21 17.32,6.91 17.32,4.9 17.6,4.62 18.17,4.62 R15.2 R16.1 18.19,2.59 18.03,2.44 14.25,2.44 14.12,2.56 C7.1 14.17,3.34 14.17,4.59 R19.1
GND  (via drill 0.3)
  Top 0.152: U$4.6 22.2,15.77 22.45,16.03 U$4.PAD 21.67,16.54 v21.64,16.51 | C11.1 20.12,16.66 v20.07,16.66 | C9.2 17.96,16.92 v17.98,16.89 | C1.1 4.76,10.13 6.02,10.13 6.12,10.11 6.96,10.11 7.95,11.1 v7.95,11.56 | R22.1 15.15,11.77 15.11,11.81 15.11,12.92 C8.1 14.53,14.01 IC1.8 | U$6.6 22.51,2.67 U$6.PAD 22.43,2.59 v20.88,2.59 20.28,2.59 C13.1 | 23.37,8.91 U$5.PAD 22.53,9.5 U$5.6 | 29.13,10.24 v29.26,10.36 | 29.23,4.34 v29.36,4.47 | U1.3 17.49,15.19 C14.1 16.48,14.86 16.23,14.61 16.23,12.47 16.43,12.27 17.77,12.27 C15.1
  Top 0.254: v8.56,13.08 8.56,12.01 IC1.30 6.51,11.99 5.92,11.99 5.51,12.39 5.51,12.93 4.78,13.66 J2.GND | v8.56,13.08 9.86,13.08 IC1.TH | v8.56,13.08 9.36,13.88 IC1.18 9.36,17.48 10.24,18.36 10.24,19.24 C10.2 | IC1.8 10.86,14.01 IC1.TH | IC1.38 9.36,11.92 9.83,12.39 9.83,12.98 IC1.TH | R3.1 5.02,18.81 v5.05,18.77 | U3.2 14.66,18.67 v14.68,18.64 | R16.2 R17.2 C7.2 C6.2 R18.2 C5.2 v8.48,1.13 v8.48,1.12 | TP24.TP 5.64,3.05 v6.43,3.05
  Bottom 0.254: v0.91,7.11 v1.02,6.5 v0.91,5.89 v1.63,5.89 v1.73,6.5 v1.63,7.11 v2.34,7.11 TP7.TP | v2.34,5.89 TP7.TP | v3.15,6.5 v3.05,5.89 2.44,5.89 TP7.TP | v3.15,6.5 v3.05,7.11 v3.76,7.11 | v3.76,7.11 v3.86,6.5 v3.76,5.89 | v3.76,7.11 2.44,7.11 TP7.TP | v3.15,6.5 TP7.TP
  other vias: 2.44,6.5 29.26,17.78 29.87,17.78 30.48,17.78 31.09,17.78 31.7,17.78 31.7,17.17 31.09,17.17 30.48,17.17 29.87,17.17 29.26,17.17 29.26,16.56 29.87,16.56 30.48,16.56 31.09,16.56 31.7,16.56 31.7,15.95 31.09,15.95 30.48,15.95 29.87,15.95 29.26,15.95 29.26,15.34 29.26,14.73 29.26,14.12 29.87,14.12 29.87,14.73 29.87,15.34 30.48,15.34 31.09,15.34 31.7,15.34 31.7,14.73 31.09,14.73 30.48,14.73 30.48,14.12 31.09,14.12 31.7,14.12 31.7,9.75 31.09,9.75 30.48,9.75 29.87,9.75 29.26,9.75 29.26,9.14 29.26,8.53 29.87,8.53 29.87,9.14 30.48,9.14 31.09,9.14 31.7,9.14 31.7,8.53 31.09,8.53 30.48,8.53 31.7,12.19 31.09,12.19 30.48,12.19 29.87,12.19 29.26,12.19 29.26,11.58 29.26,10.97 29.87,10.36 29.87,10.97 29.87,11.58 30.48,11.58 31.09,11.58 31.7,11.58 31.7,10.97 31.09,10.97 30.48,10.97 30.48,10.36 31.09,10.36 31.7,10.36 31.8,3.86 31.19,3.86 30.58,3.86 29.97,3.86 29.36,3.86 29.36,3.25 29.36,2.64 29.97,2.64 29.97,3.25 30.58,3.25 31.19,3.25 31.8,3.25 31.8,2.64 31.19,2.64 30.58,2.64 31.8,6.3 31.19,6.3 30.58,6.3 29.97,6.3 29.36,6.3 29.36,5.69 29.36,5.08 29.97,4.47 29.97,5.08 29.97,5.69 30.58,5.69 31.19,5.69 31.8,5.69 31.8,5.08 31.19,5.08 30.58,5.08 30.58,4.47 31.19,4.47 31.8,4.47 7.98,14.63 9.14,14.63 9.14,11.56 2.95,16.89 18.8,0.81 10.74,1.07 16.87,10.9 18.47,14.45 14.15,13.87 4.9,13.36 20.32,7.16 20.32,5.74
  pour Top (no thermals): 28.55,20.93 28.55,1.73 32.11,1.73 32.11,20.93
  pour Route14 (no thermals): 0.05,20.57 36.47,20.57 36.47,-0.25 0.05,-0.25
  pour Bottom (rank 6, no thermals): 0,20.73 36.58,20.73 36.58,0 4.88,0 4.88,10.57 0,10.57
  pour Top (rank 6, no thermals): 0,20.73 31.98,20.73 31.98,0 5.28,0 5.28,10.57 0,10.57
  cutout Top: 4.6,9.1 7,9.1 7,0.3 4.6,0.3
  cutout Bottom: 30.33,20.37 30.33,19.46 30.48,19.3 32.16,19.3 32.36,19.1 32.36,18.64 32.56,18.44 32.87,18.14 36.53,18.14 36.53,20.42 36.47,20.37
N$1  (via drill 0.3)
  Top 0.152: IC1.33 6.06,10.51 v5.38,11.18
  Bottom 0.152: v5.38,11.18 5.38,11.07 7.44,9.01 10.03,9.01 11.1,10.08 11.1,13.03 11.15,13.08 11.15,13.47 PROG_JMP.TP
N$2
  Top 0.254: IC1.3 13.79,11.51 15.19,10.11 15.28,10.03 R22.2 16.75,8.61 R12.2
N$3
  Top 0.152: D1.C 24.21,19.41 24.21,19.32 23.2,18.31 U$4.1 24.34,17.84 C3.2
N$4
  Top 0.152: J2.D+ 4.93,14.96 5.31,14.58 5.31,14.02 5.83,13.51 IC1.27
N$5
  Top 0.152: J2.D- 4.89,15.61 5.71,14.78 5.71,14.25 5.96,14.01 IC1.26
N$6  (via drill 0.3)
  Top 0.152: v24.2,11.49 U$5.1 24.39,10.8 C2.2 | v24.2,11.49 24.24,11.52 | 24.24,11.52 24.42,11.71 D2.C | v24.2,11.49 24.24,11.52
N$7
  Top 0.152: D3.C 24.3,5.68 23.5,4.88 23.5,4.23 U$6.1 24.54,4.22 C4.2
N$12
  Bottom 0.152: 17.27,4.46 16.9,4.46 16.83,4.53 | U$7.P$12 17.27,4.46 | 17.46,4.64 17.27,4.46
  Bottom 0.305: 13.82,5.06 L1.1
  Bottom 0.406: D6.C 18.45,5.64 17.46,4.64 | 16.83,4.53 16.29,5.06 13.82,5.06 13.73,5.15 C25.1
N$14
  Bottom 0.152: U$7.P$10
  Bottom 0.203: U$7.P$10 16.55,3.53
  Bottom 0.305: L1.2 13.9,2.9 15.92,2.9 16.55,3.53
  Bottom 0.406: R4.1 14.18,1.85 13.9,2.13 13.9,2.9
N$15
  Top 0.254: 2.97,19.29 2.09,18.41 J2.SHLD4 1.53,18.37 1.52,18.36 J2.SHLD6 J2.SHLD8 J2.SHLD7 J2.SHLD5 J2.SHLD3 3.01,11.46 | 2.97,19.29 R3.2 | J2.SHLD2 2.97,18.77 2.97,19.29 | 3.01,11.46 C1.2 | J2.SHLD1 3.01,12.41 3.01,11.46
N$16
  Bottom 0.203: U$7.P$11 12.13,3.98 11.68,4.42 11.68,5.59 12.09,5.99 12.7,5.99 12.8,6.1 12.8,7.16 13.08,7.44 14.54,7.44
  Bottom 0.305: C25.2 15.33,6.66 14.54,7.44 14.54,8.4 D5.1
PDI_DATA  (via drill 0.3)
  Top 0.254: IC1.34 6.07,9.68 v5.94,9.55 | v5.64,6.68 5.77,6.48 TP21.TP
  Route3 0.406: v5.94,9.55 5.94,6.71 v5.64,6.68
RC_SIG_IC  (via drill 0.3)
  Top 0.152: R1.2 6.54,2.3 7.14,2.9 7.14,3.91 v6.83,4.22 | v14.17,12.98 14.17,12.45 13.74,12.01 13.19,12.01
  Top 0.254: 13.19,12.01 IC1.4
  Bottom 0.152: v6.83,4.22 7.21,4.59 7.21,5.59 8.5,6.88 8.78,6.88 14.17,12.27 v14.17,12.98
RC_SIG_RCV  (via drill 0.3)
  Top 0.254: v0.91,0.81 v1.02,1.42 v0.91,2.03 v1.63,2.03 | v1.63,2.03 v1.73,1.42 v1.63,0.81 | v2.34,0.81 RX_IN_PIN.TP | RX_IN_PIN.TP v2.34,2.03 v1.63,2.03 | RX_IN_PIN.TP v3.15,1.42 | v3.15,1.42 v3.05,2.03 | v3.15,1.42 v3.05,0.81 v3.76,0.81 v3.86,1.42 | v3.86,1.42 v3.76,2.03 | v3.86,1.42 4.48,1.42 R1.1
  other vias: 2.44,1.42
RST_PDICLK
  Top 0.254: TP22.TP 6.79,8.33 R5.2 7.39,8.67 7.39,8.69 7.86,9.15 IC1.35
RX_DIRECT_PD2  (via drill 0.3)
  Top 0.152: v8.23,19 7.7,19
  Top 0.254: IC1.22 7.36,16.88 7.7,17.22 7.7,19 7.7,19.13 7.37,19.46 6.82,19.46 R2.2
  Bottom 0.152: v3.86,8.94 3.86,11.43 3.4,11.89 3.4,12.75 6.12,15.47 6.12,16.89 v8.23,19
  Bottom 0.254: v0.91,8.33 v1.02,8.94 v0.91,9.55 v1.63,9.55 v1.73,8.94 v1.63,8.33 v2.34,8.33 RX_DIRECT.TP v3.15,8.94 v3.05,8.33 v3.76,8.33 v3.86,8.94
  other vias: 2.44,8.94
SUM_UVW
  Top 0.254: R19.2 R20.2 R21.2 10.36,6.63 IC1.40
TX_DIRECT_PD3
  Top 0.254: R2.1 6.71,15.68 IC1.23
U  (via drill 0.3)
  Top 0.152: C3.1 26.18,14.3 U$1.TGR | R13.1 8.06,6.3 v8.74,6.3 | v24.21,15.98 24.57,15.9 C3.1 | U$4.7 22.7,14.71 24.21,14.71 24.66,15.16 C3.1
  Bottom 0.152: v24.21,15.98 23.13,14.9 19.9,14.9 19,15.8 18,15.8 16.2,17.6 13.8,17.6 12.59,18.81 10.45,18.81 9.3,17.66 9.3,16.92 9.8,16.42 11.07,16.42 11.42,16.07 12.03,16.07 12.41,15.68 13.34,15.68 14.75,14.27 14.75,12.31 v8.74,6.3
U_DISABLE_DRIVE  (via drill 0.3)
  Top 0.152: U$4.3 22.2,18.44 v22.12,18.57 | IC1.10 13.63,15.01 15.14,16.51 16.03,16.51 16.76,15.77 18.8,15.77 19.1,16.08 v20.75,16.08
  Bottom 0.152: v22.12,18.57 20.75,17.2 v20.75,16.08
U_GATE_HIGH
  Top 0.152: U$4.8 23.6,15.63 23.6,16.28 23.98,16.66 25.27,16.66 26.37,15.57 U$1.TG
U_LOW_GATE  (via drill 0.3)
  Top 0.152: U$4.5 21.7,14.36 22.25,13.82 23.04,13.82 23.6,14.38 25.4,14.38 26.24,13.54 27.89,13.54 v28.14,13.28 | v32.92,13.51 32.92,14.21 U$1.BG
  Bottom 0.152: v32.92,13.51 32.89,13.49 28.35,13.49 v28.14,13.28
U_PWM_DRIVE  (via drill 0.3)
  Top 0.152: U$4.2 22.7,18.26 23.01,18.57 v23.01,18.95 | IC1.11 13.26,15.52 13.69,15.52 15.04,16.87 16.13,16.87 16.89,16.1 18.54,16.1 19.05,16.61 19.05,19.3 v19.02,19.33
  Bottom 0.152: v19.02,19.33 22.63,19.33 v23.01,18.95
UMOT  (via drill 0.3)
  other vias: 35.56,15.14 34.95,15.14 34.34,15.14 34.34,14.53 34.95,14.53 35.56,14.53 35.56,13.92 34.95,13.92 34.34,13.92 35.56,17.58 34.95,17.58 34.34,17.58 33.73,17.58 33.73,15.75 33.73,16.36 33.73,16.97 34.34,16.97 34.95,16.97 35.56,16.97 35.56,16.36 34.95,16.36 34.34,16.36 34.34,15.75 34.95,15.75 35.56,15.75
  pour Top (no thermals): 32.69,18.11 32.74,15.42 33.73,15.44 33.73,13.41 36.98,13.41 36.93,18.14
V  (via drill 0.3, 0.35)
  Top 0.152: v23.01,7.52 23.03,7.54 | 23.03,7.54 U$5.7 | 23.03,7.54 23.78,7.54 C2.1 25.09,8.4 U$2.TGR
  Top 0.254: R14.1 16.15,6.2 v16.64,5.71
  Route14 0.152: v19.66,7.52 19.88,7.74 22.79,7.74 v23.01,7.52
  Bottom 0.254: v16.64,5.71 18.44,7.52 v19.66,7.52
V_DISABLE_DRIVE  (via drill 0.3)
  Top 0.152: U$5.3 22.53,11.76 v22.45,11.76 | IC1.12 12.9,16.33 v12.9,16.87
  Bottom 0.152: v22.45,11.76 22.61,11.91 22.61,13.88 22.19,14.29 19.65,14.29 18.77,15.17 17.7,15.17 16,16.87 v12.9,16.87
V_HIGH_GATE
  Top 0.152: U$5.8 23.8,8.2 24.03,8.43 24.03,9.3 24.18,9.45 27.35,9.45 U$2.TG
V_LOW_GATE  (via drill 0.3)
  Top 0.152: v32.94,7.57 32.94,8.39 U$2.BG | U$5.5 22.03,7.79 22.8,7.02 23.22,7.02 23.43,7.23 24.03,7.23 24.33,7.53 28.32,7.53 v28.37,7.47
  Bottom 0.152: v28.37,7.47 32.82,7.44 v32.94,7.57
V_PWM_DRIVE  (via drill 0.3)
  Top 0.152: U$5.2 23.03,11.48 23.37,11.81 v23.42,12.04 | IC1.13 11.86,17.25 11.96,17.25 v12.06,17.35
  Bottom 0.152: v23.42,12.04 23.09,12.37 23.09,13.82 22.32,14.6 19.77,14.6 18.9,15.47 17.82,15.47 16.12,17.18 13.41,17.18 13.14,17.44 12.16,17.44 v12.06,17.35
VCC  (via drill 0.3)
  Top 0.152: U1.2 20.51,12.86 20.51,12.12 | 20.51,12.12 C15.2 18.45,9.17 R12.1 | v19.94,12.19 19.94,12.12 20.51,12.12 | v26.31,12.19 25.86,12.65 25.86,13.44 25.3,13.99 23.67,13.99 23.14,13.46 23.14,12.68 22.94,12.47 22.02,12.47 21.74,12.19 v21.26,12.19
  Bottom 0.15: U$7.P$2 20.16,3.81 20.23,3.71
  Bottom 0.152: U$7.P$2 U$7.P$3 20.23,3.71 | v21.26,12.19 v19.94,12.19
  Bottom 0.254: U$7.P$1 U$7.P$2
  Bottom 0.406: 20.23,3.71 20.68,3.71 21.95,2.44 C26.2 22.86,2.47 22.86,2.79 23.27,3.2 23.27,4.22 25.7,6.66 26.92,6.66 27.48,7.26 27.5,7.44 27.5,8.99 C19.1
  other vias: 26.92,18.16 26.31,18.16 26.31,17.55 26.92,17.55 26.92,16.94 26.31,16.94 26.92,12.19 26.92,11.58 26.31,11.58 26.31,10.97 26.92,10.97 26.92,6.3 26.31,6.3 26.31,5.69 26.92,5.69 26.92,5.08 26.31,5.08
  pour Bottom (no thermals): 28.63,20.88 29.62,20.88 29.62,18.8 28.55,18.8 28.55,18.54 28.57,4.78 24.08,4.78 24.08,20.83
  pour Top (no thermals): 27.99,12.5 27.99,10.64 26.01,10.64 26.01,12.5
  pour Top (isolate 0.254, no thermals): 27.94,16.59 27.94,18.49 26.01,18.49 26.01,16.59
  pour Top (no thermals): 27.94,6.6 25.98,6.6 25.98,4.78 27.94,4.78
  pour Route3 (no thermals): 26.01,20.73 36.58,20.73 36.58,4.5 36.5,0.5 26.01,0.5 26.01,4.5
VMOT  (via drill 0.3)
  other vias: 35.56,9.04 34.95,9.04 34.34,9.04 34.34,8.43 34.95,8.43 35.56,8.43 35.56,7.82 34.95,7.82 34.34,7.82 35.56,11.48 34.95,11.48 34.34,11.48 33.73,11.48 33.73,9.65 33.73,10.26 33.73,10.87 34.34,10.87 34.95,10.87 35.56,10.87 35.56,10.26 34.95,10.26 34.34,10.26 34.34,9.65 34.95,9.65 35.56,9.65
  pour Top (no thermals): 32.72,12.6 36.58,12.6 36.58,7.72 33.93,7.72 33.93,9.35 32.72,9.35
W
  Top 0.152: R15.1 18.91,6.34 19.2,6.04 19.2,2.06 19.52,1.74 20.74,1.74 21.51,0.96 22.91,0.96 22.99,1.04 | 22.99,1.04 22.99,1.6 U$6.7 | 22.99,1.04 23.27,0.76 23.42,0.76 24.18,0.76 24.74,1.32 24.74,2.27 C4.1 24.98,2.51 U$3.TGR
W_DISABLE_DRIVE  (via drill 0.3)
  Top 0.152: U$6.3 22.51,4.64 v22.05,5.18 | IC1.14 11.36,17.96 v10.74,17.96
  Bottom 0.152: v22.05,5.18 22.25,5.38 22.25,7.14 22.21,7.19 22.21,7.31 13.53,15.98 12.54,15.98 12.15,16.37 11.54,16.37 11.19,16.72 9.95,16.72 9.61,17.06 9.61,17.54 10.03,17.96 v10.74,17.96
W_HIGH_GATE
  Top 0.152: U$3.TG 27,3.79 26.36,3.15 24.08,3.15 23.98,3.05 23.98,1.78 23.82,1.62 U$6.8
W_LOW_GATE  (via drill 0.3)
  Top 0.152: U$3.BG 32.96,1.35 v33.27,1.04 | v21.34,1.98 21.7,1.62 U$6.5
  Bottom 0.152: v33.27,1.04 22.28,1.04 v21.34,1.98
W_PWM_DRIVE  (via drill 0.3)
  Top 0.152: U$6.2 23.01,5.15 v22.96,5.23 | IC1.15 10.86,17.3 v10.19,17.3
  Bottom 0.152: v22.96,5.23 22.58,5.61 22.58,7.24 22.51,7.31 22.51,7.49 13.71,16.29 12.66,16.29 12.28,16.67 11.67,16.67 11.15,17.19 10.29,17.19 v10.19,17.3
WMOT  (via drill 0.3)
  other vias: 35.56,3.25 34.95,3.25 34.34,3.25 34.34,2.64 34.95,2.64 35.56,2.64 35.56,2.03 34.95,2.03 34.34,2.03 35.56,5.69 34.95,5.69 34.34,5.69 33.73,5.69 33.73,3.86 33.73,4.47 33.73,5.08 34.34,5.08 34.95,5.08 35.56,5.08 35.56,4.47 34.95,4.47 34.34,4.47 34.34,3.86 34.95,3.86 35.56,3.86
  pour Top (no thermals): 32.72,6.71 32.72,3.45 33.93,3.45 33.93,1.83 36.58,1.83 36.58,6.71

### Text on the board
Bottom: JuWi made | + | (c)2018 | -
bStop: + | -